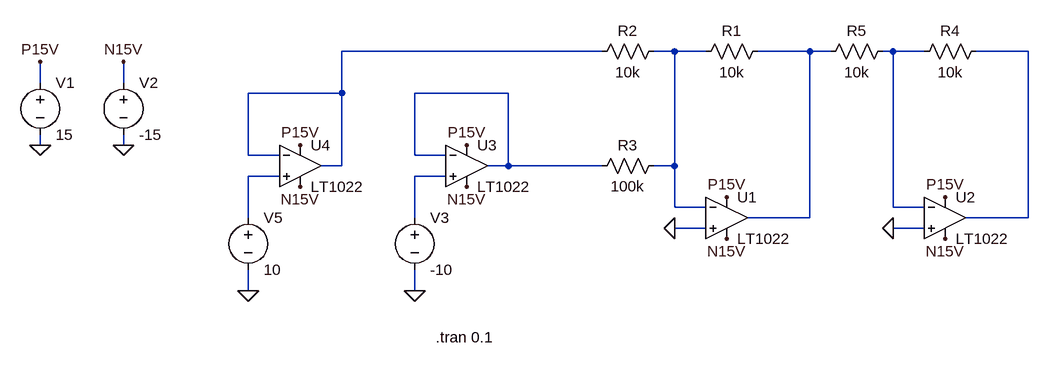
[diagram p0: schematic SumAmp.asc]
SumAmp.asc, the LTspice schematic file:
Version 4.1
SHEET 1 880 680
WIRE 48 -128 -352 -128
WIRE 160 -128 128 -128
WIRE 208 -128 160 -128
WIRE 368 -128 288 -128
WIRE 400 -128 368 -128
WIRE 496 -128 480 -128
WIRE 544 -128 496 -128
WIRE 704 -128 624 -128
WIRE -816 -80 -816 -112
WIRE -688 -80 -688 -112
WIRE -352 -64 -352 -128
WIRE -352 -64 -496 -64
WIRE -96 -64 -240 -64
WIRE -816 16 -816 0
WIRE -688 16 -688 0
WIRE -496 32 -496 -64
WIRE -448 32 -496 32
WIRE -240 32 -240 -64
WIRE -192 32 -240 32
WIRE -352 48 -352 -64
WIRE -352 48 -384 48
WIRE -96 48 -96 -64
WIRE -96 48 -128 48
WIRE 48 48 -96 48
WIRE 160 48 160 -128
WIRE 160 48 128 48
WIRE -448 64 -496 64
WIRE -192 64 -240 64
WIRE 160 112 160 48
WIRE 208 112 160 112
WIRE 496 112 496 -128
WIRE 544 112 496 112
WIRE -496 128 -496 64
WIRE -240 128 -240 64
WIRE 368 128 368 -128
WIRE 368 128 272 128
WIRE 704 128 704 -128
WIRE 704 128 608 128
WIRE 208 144 160 144
WIRE 544 144 496 144
WIRE -496 240 -496 208
WIRE -240 240 -240 208
FLAG 160 144 0
FLAG -240 240 0
FLAG 496 144 0
FLAG -816 16 0
FLAG -688 16 0
FLAG -816 -112 P15V
FLAG -688 -112 N15V
FLAG 240 96 P15V
FLAG 576 96 P15V
FLAG -160 16 P15V
FLAG -160 80 N15V
FLAG 240 160 N15V
FLAG 576 160 N15V
FLAG -496 240 0
FLAG -416 16 P15V
FLAG -416 80 N15V
SYMBOL OpAmps\\LT1022 240 64 R0
SYMATTR InstName U1
SYMBOL res 304 -144 R90
WINDOW 0 0 56 VBottom 2
WINDOW 3 32 56 VTop 2
SYMATTR InstName R1
SYMATTR Value 10k
SYMBOL res 144 -144 R90
WINDOW 0 0 56 VBottom 2
WINDOW 3 32 56 VTop 2
SYMATTR InstName R2
SYMATTR Value 10k
SYMBOL res 144 32 R90
WINDOW 0 0 56 VBottom 2
WINDOW 3 32 56 VTop 2
SYMATTR InstName R3
SYMATTR Value 100k
SYMBOL voltage -240 112 R0
WINDOW 123 0 0 Left 0
WINDOW 39 0 0 Left 0
SYMATTR InstName V3
SYMATTR Value -10
SYMBOL OpAmps\\LT1022 576 64 R0
SYMATTR InstName U2
SYMBOL res 640 -144 R90
WINDOW 0 0 56 VBottom 2
WINDOW 3 32 56 VTop 2
SYMATTR InstName R4
SYMATTR Value 10k
SYMBOL res 496 -144 R90
WINDOW 0 0 56 VBottom 2
WINDOW 3 32 56 VTop 2
SYMATTR InstName R5
SYMATTR Value 10k
SYMBOL OpAmps\\LT1022 -160 -16 R0
SYMATTR InstName U3
SYMBOL voltage -816 -96 R0
WINDOW 123 0 0 Left 0
WINDOW 39 0 0 Left 0
SYMATTR InstName V1
SYMATTR Value 15
SYMBOL voltage -688 -96 R0
WINDOW 123 0 0 Left 0
WINDOW 39 0 0 Left 0
SYMATTR InstName V2
SYMATTR Value -15
SYMBOL voltage -496 112 R0
WINDOW 123 0 0 Left 0
WINDOW 39 0 0 Left 0
SYMATTR InstName V5
SYMATTR Value 10
SYMBOL OpAmps\\LT1022 -416 -16 R0
SYMATTR InstName U4
TEXT -208 312 Left 2 !.tran 0.1

The netlist it stands for:
* SumAmp.asc
X§U1 0 N002 P15V N15V N003 LT1022  ; pins In+ In- V+ V- OUT
R1 N003 N002 10k
R2 N002 N001 10k
R3 N002 N006 100k
V3 N008 0 -10
X§U2 0 N004 P15V N15V N005 LT1022  ; pins In+ In- V+ V- OUT
R4 N005 N004 10k
R5 N004 N003 10k
X§U3 N008 N006 P15V N15V N006 LT1022  ; pins In+ In- V+ V- OUT
V1 P15V 0 15
V2 N15V 0 -15
V5 N007 0 10
X§U4 N007 N001 P15V N15V N001 LT1022  ; pins In+ In- V+ V- OUT
.tran 0.1
.backanno
.end